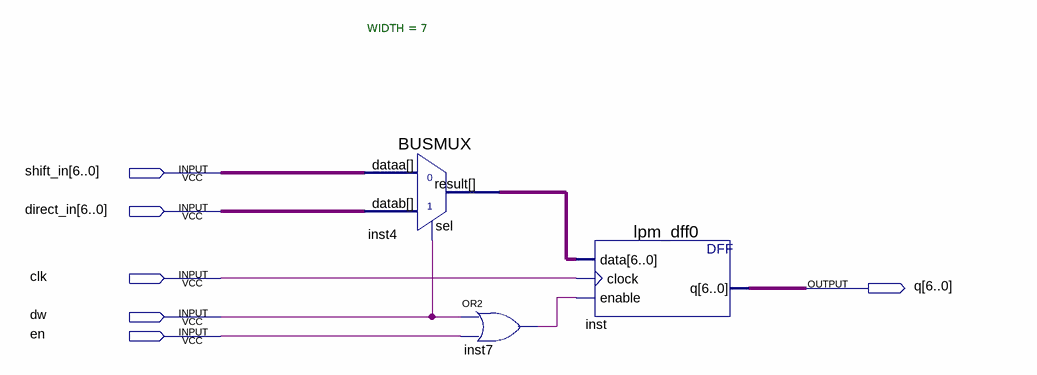
[diagram p0: schematic sheet]
// Quartus schematic data_cell.bdf as structural Verilog: 3 symbols, 6 pins
module data_cell (
  input  [6:0] shift_in,
  input  [6:0] direct_in,
  input  clk,
  input  dw,
  input  en,
  output [6:0] q
);

  wire inst7_out;
  wire [6:0] inst4_result;

  BUSMUX #(.WIDTH(7)) inst4 (.datab(direct_in), .sel(dw), .dataa(shift_in), .result(inst4_result));
  or inst7 (inst7_out, dw, en);
  lpm_dff0 inst (.data(inst4_result), .clock(clk), .enable(inst7_out), .q(q));
endmodule
